# EAGLE design Mimi_layout (EAGLE 7.6.0)

## Sheet 1 of 2
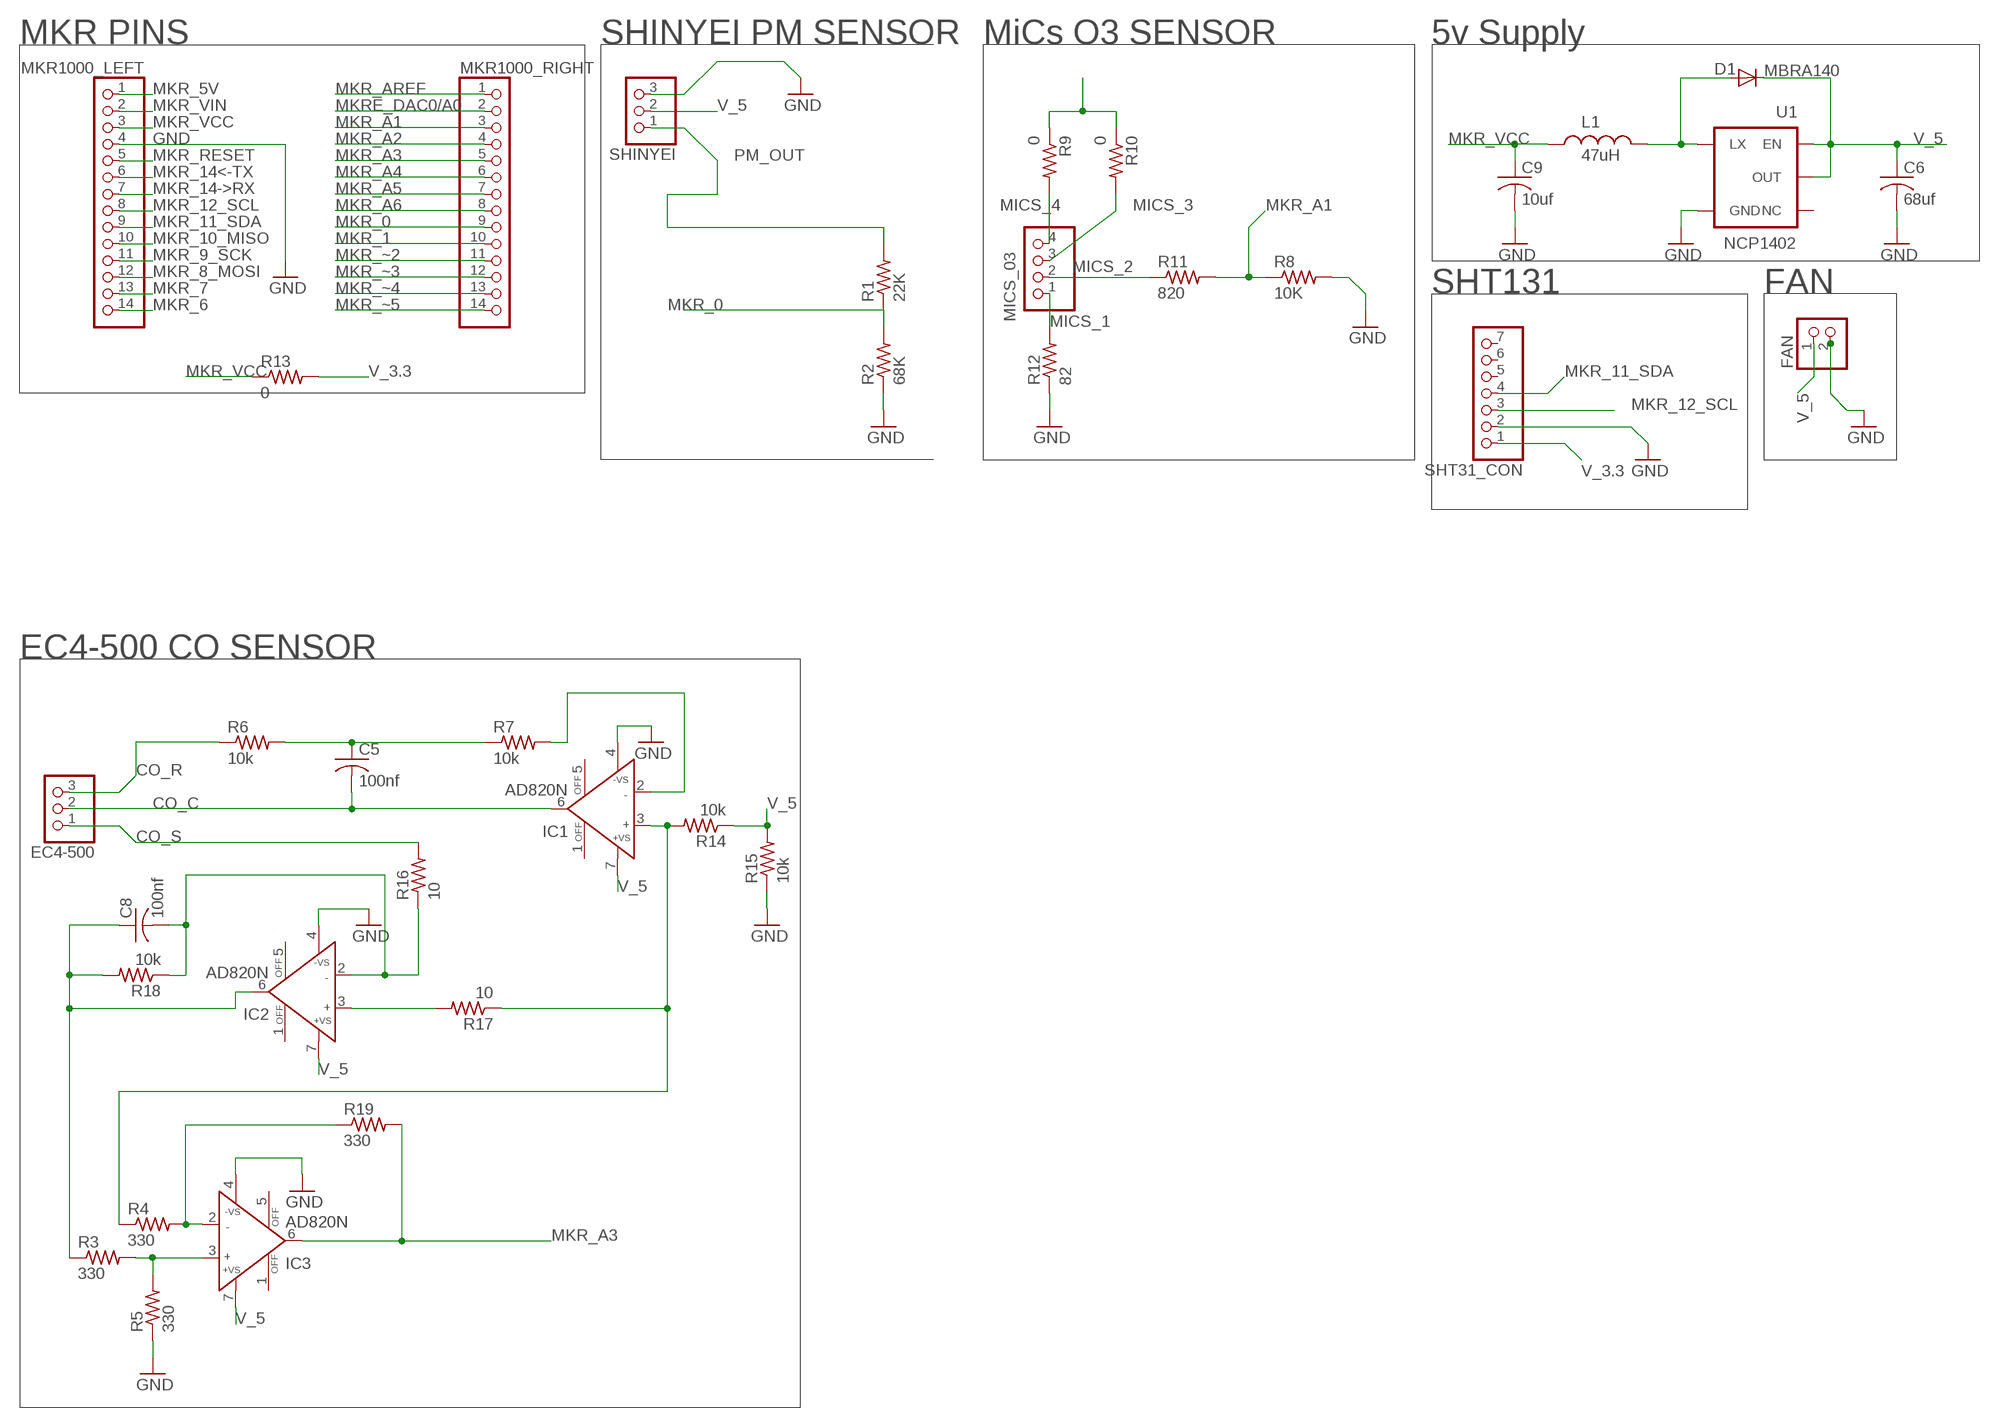
[diagram p0: schematic, sheet 1]

### Parts
C5  100nf  C-USC0805  [C0805]
C6  68uf  C-USC0805  [C0805]
C8  100nf  C-USC0805  [C0805]
C9  10uf  C-USC0805  [C0805]
D1  MBRA140  DIODESMA  [SMA-DIODE]
EC4-500  PINHD-1X3  [1X03]
FAN  PINHD-1X2  [1X02]
IC1  AD820N  [DIL08]
IC2  AD820N  [DIL08]
IC3  AD820N  [DIL08]
L1  47uH  INDUCTORCR54  [CR54]
MICS_03  PINHD-1X4  [1X04]
MKR1000_LEFT  PINHD-1X14  [1X14]
MKR1000_RIGHT  PINHD-1X14  [1X14]
R1  22K  R-US_R0805  [R0805]
R2  68K  R-US_R0805  [R0805]
R3  330  R-US_R0805  [R0805]
R4  330  R-US_R0805  [R0805]
R5  330  R-US_R0805  [R0805]
R6  10k  R-US_R0805  [R0805]
R7  10k  R-US_R0805  [R0805]
R8  10K  R-US_R0805  [R0805]
R9  0  R-US_R0805  [R0805]
R10  0  R-US_R0805  [R0805]
R11  820  R-US_R0805  [R0805]
R12  82  R-US_R0805  [R0805]
R13  0  R-US_R0805  [R0805]
R14  10k  R-US_R0805  [R0805]
R15  10k  R-US_R0805  [R0805]
R16  10  R-US_R0805  [R0805]
R17  10  R-US_R0805  [R0805]
R18  10k  R-US_R0805  [R0805]
R19  330  R-US_R0805  [R0805]
SHINYEI  PINHD-1X3  [1X03]
SHT31_CON  PINHD-1X7  [1X07]
U1  NCP1402  V_REG_NCP1400SOT23-5  [SOT23-5]

### Nets
CO_C: C5.2 EC4-500.2 IC1.6(OUT)
CO_R: EC4-500.3 R6.1
CO_S: EC4-500.1 R16.2
GND: C6.2 C9.2 FAN.2 IC1.4(-VS) IC2.4(-VS) IC3.4(-VS) MKR1000_LEFT.4 R2.1 R5.1 R8.2 R12.1 R15.1 SHINYEI.3 SHT31_CON.2 U1.4(GND)
MICS_1: MICS_03.1 R12.2
MICS_2: MICS_03.2 R11.1
MICS_3: MICS_03.3 R10.2
MICS_4: MICS_03.4 R9.2
MKR_0: MKR1000_RIGHT.9 R1.1 R2.2
MKR_1: MKR1000_RIGHT.10
MKR_5V: MKR1000_LEFT.1
MKR_6: MKR1000_LEFT.14
MKR_7: MKR1000_LEFT.13
MKR_8_MOSI: MKR1000_LEFT.12
MKR_9_SCK: MKR1000_LEFT.11
MKR_10_MISO: MKR1000_LEFT.10
MKR_11_SDA: MKR1000_LEFT.9 SHT31_CON.4
MKR_12_SCL: MKR1000_LEFT.8 SHT31_CON.3
MKR_14->RX: MKR1000_LEFT.7
MKR_14<-TX: MKR1000_LEFT.6
MKR_A1: MKR1000_RIGHT.3 R8.1 R11.2
MKR_A2: MKR1000_RIGHT.4
MKR_A3: IC3.6(OUT) MKR1000_RIGHT.5 R19.2
MKR_A4: MKR1000_RIGHT.6
MKR_A5: MKR1000_RIGHT.7
MKR_A6: MKR1000_RIGHT.8
MKR_AREF: MKR1000_RIGHT.1
MKR_RESET: MKR1000_LEFT.5
MKR_VCC: C9.1 L1.P$1 MKR1000_LEFT.3 R13.1
MKR_VIN: MKR1000_LEFT.2
MKR_~2: MKR1000_RIGHT.11
MKR_~3: MKR1000_RIGHT.12
MKR_~4: MKR1000_RIGHT.13
MKR_~5: MKR1000_RIGHT.14
MKRE_DAC0/A0: MKR1000_RIGHT.2
N$3: D1.A L1.P$2 U1.5(LX)
N$4: C5.1 R6.2 R7.1
N$5: IC1.3(IN+) R4.1 R14.2 R17.1
N$6: IC1.2(IN-) R7.2
N$7: IC2.3(IN+) R17.2
N$8: C8.2 IC2.2(IN-) R16.1 R18.1
N$9: C8.1 IC2.6(OUT) R3.1 R18.2
N$10: IC3.3(IN+) R3.2 R5.2
N$11: IC3.2(IN-) R4.2 R19.1
PM_OUT: R1.2 SHINYEI.1
V_3.3: R13.2 SHT31_CON.1
V_5: C6.1 D1.C FAN.1 IC1.7(+VS) IC2.7(+VS) IC3.7(+VS) R9.1 R10.1 R14.1 R15.2 SHINYEI.2 U1.1(EN) U1.2(OUT)
Unconnected: IC1.1(OFF) IC1.5(OFF) IC2.1(OFF) IC2.5(OFF) IC3.1(OFF) IC3.5(OFF) SHT31_CON.5 SHT31_CON.6 SHT31_CON.7 U1.3(NC)

### Notes on the sheet
- MKR PINS | SHINYEI PM SENSOR | MiCs O3 SENSOR | 5v Supply
- SHT131 | FAN
- EC4-500 CO SENSOR

## Sheet 2 of 2

## Library data of the parts
C5 C6 C8 C9 = resistor:C-US: CAPACITOR, American symbol
D1 = SparkFun:DIODE: Diode These are standard reverse protection diodes and small signal diodes. SMA package can handle up to about 1A. SOD-323 can handle about 200mA. What the SOD-323 package when ordering, there are some mfgs out there that are 5-pin packages.
EC4-500 SHINYEI = pinhead:PINHD-1X3: PIN HEADER
FAN = pinhead:PINHD-1X2: PIN HEADER
IC1-IC3 = analog-devices:AD820N: Single-Supply, Rail-to-Rail, Low Power, FET Input Op Amp Source: http://www.analog.com/static/imported-files/data_sheets/AD820.pdf; OC_FARNELL: 1438579; OC_NEWARK: unknown
L1 = SparkFun:INDUCTOR: Inductors Basic Inductor/Choke - 0603 and 1206. Footprints are not proven and vary greatly between part numbers.
MICS_03 = pinhead:PINHD-1X4: PIN HEADER
MKR1000_LEFT MKR1000_RIGHT = pinhead:PINHD-1X14: PIN HEADER
R1-R19 = resistor:R-US_: RESISTOR, American symbol
SHT31_CON = pinhead:PINHD-1X7: PIN HEADER
U1 = SparkFun:V_REG_NCP1400: Switching step-up voltage regulator NCP1400 switiching regulator takes single cell AA and outputs 100mA at 3.3V or 5V with minimal number of external components.

## Board
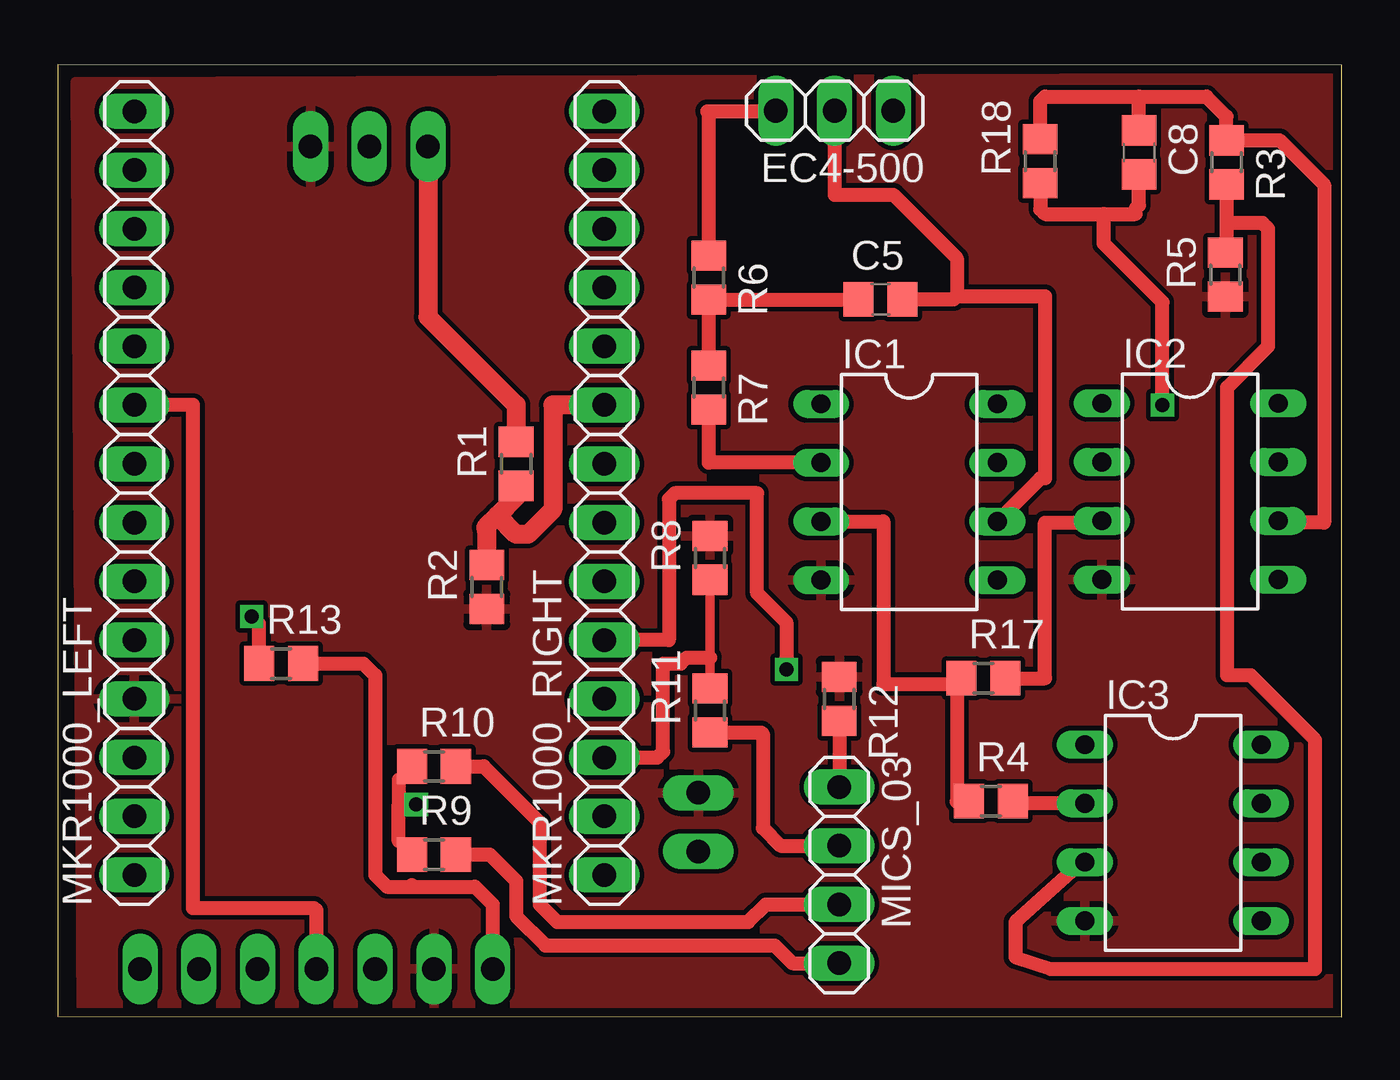
[diagram p1: board, top side]
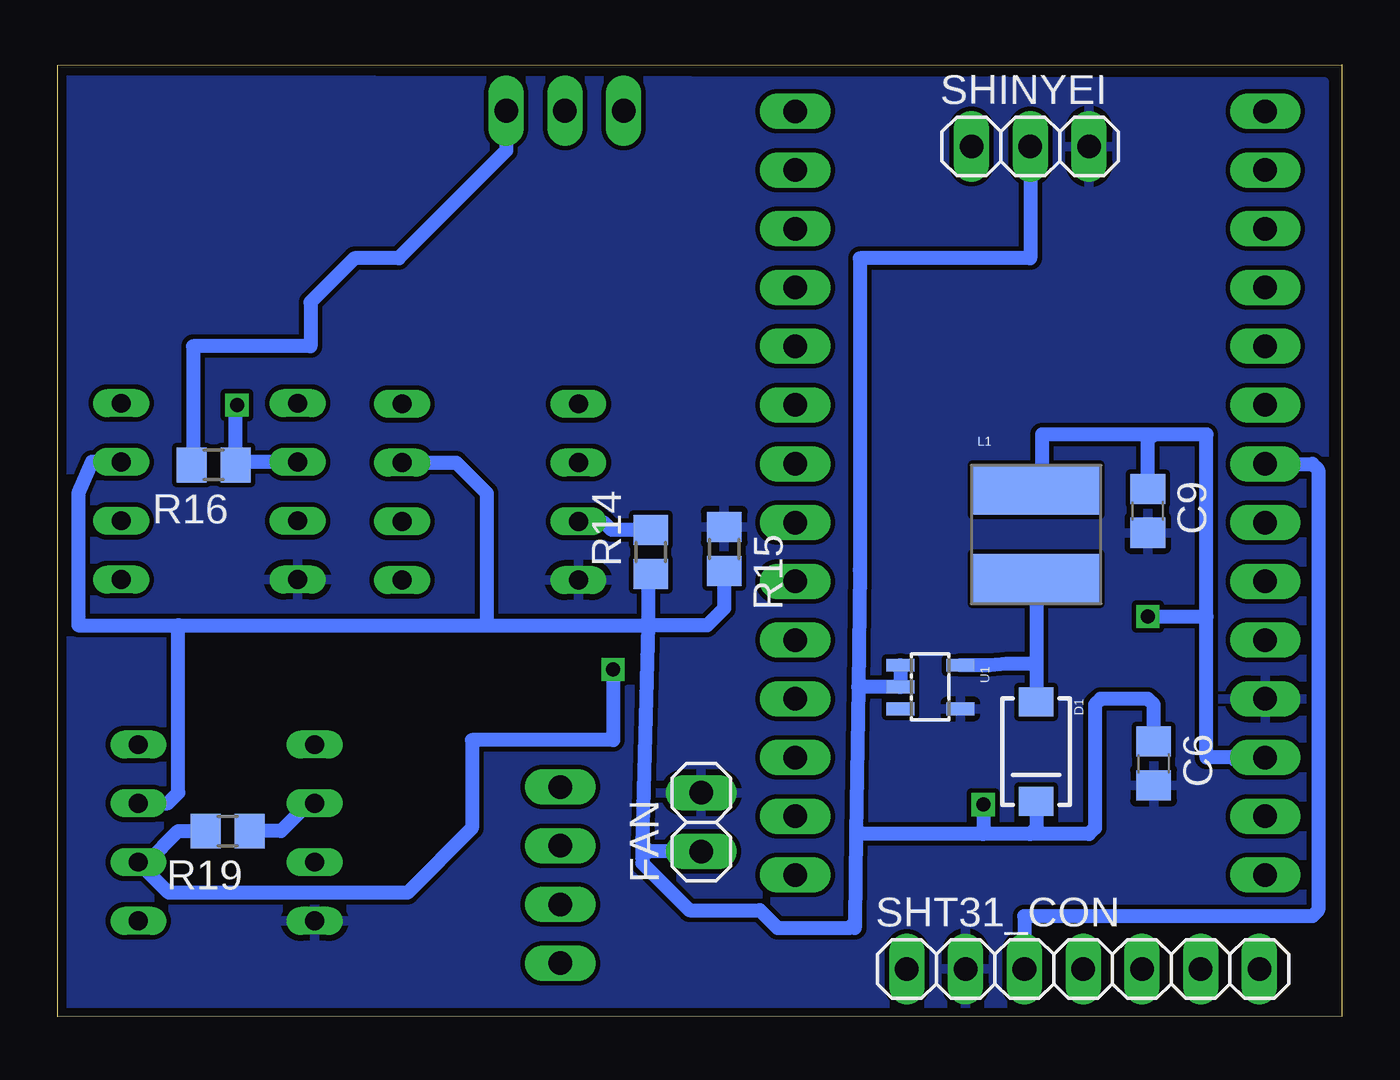
[diagram p2: board, bottom side, seen from below]

Size 55.5 x 41.16 mm. Coordinates in mm from the lower left corner, seen from the top.
Outline: 0,0.03 55.5,0 55.5,41.14 0,41.16 0,0.03
Copper layers (1*16): Top 0.0178mm / dielectric 59mil / Bottom 0.0178mm
Design rules "epl-lpkf": minimum track width 8mil, minimum drill 0.35mm, track to track 8mil, track to pad 8mil, pad to pad 8mil, via to via 8mil, smd to smd 8mil, copper to edge 15mil, drill to drill 15mil, minimum pad ring 8mil, minimum via ring 8mil, stop-mask expansion 3mil, vias tented up to drill 0mil, thermal gap 10mil

### Footprints (pad centres in the part's own frame; a part is rotated, then mirrored left to right if it is on the bottom)
C0805 = smd 1.3 x 1.5: 1 -0.95,0; 2 0.95,0
SMA-DIODE = smd 1.27 x 1.47: A -2.15,0; C 2.15,0
1X03 = drill 1.016 long: 1 -2.54,0; 2 0,0; 3 2.54,0
1X02 = drill 1.016 long: 1 -1.27,0; 2 1.27,0
DIL08 = drill 0.813 long: 1 -3.81,-3.81; 2 -1.27,-3.81; 3 1.27,-3.81; 4 3.81,-3.81; 5 3.81,3.81; 6 1.27,3.81; 7 -1.27,3.81; 8 -3.81,3.81
CR54 = smd 5.5 x 2.15: P$1 0,1.92; P$2 0,-1.92
1X04 = drill 1.016 long: 1 -3.81,0; 2 -1.27,0; 3 1.27,0; 4 3.81,0
1X14 = drill 1.016 long: 1 -16.51,0; 2 -13.97,0; 3 -11.43,0; 4 -8.89,0; 5 -6.35,0; 6 -3.81,0; 7 -1.27,0; 8 1.27,0; 9 3.81,0; 10 6.35,0; 11 8.89,0; 12 11.43,0; 13 13.97,0; 14 16.51,0
R0805 = smd 1.3 x 1.5: 1 -0.95,0; 2 0.95,0
1X07 = drill 1.016 long: 1 -7.62,0; 2 -5.08,0; 3 -2.54,0; 4 0,0; 5 2.54,0; 6 5.08,0; 7 7.62,0
SOT23-5 = smd 0.55 x 1.2: 1 -0.95,-1.3; 2 0,-1.3; 3 0.95,-1.3; 4 0.95,1.3; 5 -0.95,1.3

### Placement (x,y rotation side)
C5  35.56,31.01 0 top
C6  8.13,10.95 270 bottom
C8  46.74,37.36 270 top
C9  8.38,21.87 270 bottom
D1  13.21,11.46 270 bottom
EC4-500  33.58,39.17 180 top
FAN  27.69,8.41 90 bottom
IC1  36.8,22.68 270 top
IC2  48.95,22.71 270 top
IC3  48.21,7.95 270 top
L1  13.21,20.85 0 bottom
MICS_03  33.78,6.12 270 top
MKR1000_LEFT  3.3,22.63 90 top
MKR1000_RIGHT  23.62,22.63 90 top
R1  19.81,23.9 90 top
R2  18.54,18.57 90 top
R3  50.52,36.93 270 top
R4  40.34,9.32 0 top
R5  50.47,32.08 90 top
R6  28.14,31.95 270 top
R7  28.14,27.2 270 top
R8  28.19,19.84 90 top
R9  16.26,7.01 0 top
R10  16.26,10.82 0 top
R11  28.19,13.23 90 top
R12  33.78,13.74 270 top
R13  9.65,15.27 0 top
R14  29.87,20.09 90 bottom
R15  26.7,20.22 270 bottom
R16  48.77,23.85 180 bottom
R17  40.01,14.63 0 top
R18  42.47,36.98 90 top
R19  48.16,8.03 180 bottom
SHINYEI  13.46,37.62 0 bottom
SHT31_CON  11.18,2.06 0 bottom
U1  17.78,14.25 270 bottom

### Tracks (layer width: path | path; a pad name or v marks a point on that pad's centre or on a via)
CO_C
  Top 0.61: 38.86,31.14 42.67,31.14 42.67,23.27 42.47,23.27 IC1.6 | EC4-500.2 33.58,35.53 36.12,35.53 38.86,32.79 38.86,31.14 | C5.2 38.73,31.01 38.86,31.14
CO_R
  Top 0.61: R6.1 28.14,39.07 28.07,39.14 31.01,39.14 EC4-500.3
CO_S
  Bottom 0.61: EC4-500.1 36.12,37.44 40.77,32.79 42.67,32.79 44.58,30.89 44.58,28.98 49.66,28.98 49.66,23.91 R16.2
GND
  pour Bottom: 0.76,40.41 55.45,40.51 55.45,0.13 0.76,0.03
  pour Top: 0.76,40.41 55.45,40.61 55.7,0.23 1.02,0.03
MICS_1
  Top 0.61: R12.2 MICS_03.1
MICS_2
  Top 0.61: 33.78,7.71 MICS_03.2 31.24,7.39 30.48,8.15 30.48,12.22 30.41,12.28 R11.1
MICS_3
  Top 0.61: MICS_03.3 30.61,4.85 29.84,4.09 21.59,4.09 20.83,4.85 20.83,8.41 18.41,10.82 R10.2
MICS_4
  Top 0.61: MICS_03.4 31.75,2.31 30.99,3.07 21.08,3.07 19.81,4.34 19.81,5.87 18.67,7.01 R9.2
MKR_0
  Top 0.813: MKR1000_RIGHT.9 21.4,26.44 21.4,21.94 20.32,20.85 19.81,20.85 19,21.67 | R2.2 18.54,20.96 18.49,21.16 19,21.67 | R1.1 19.81,22.48 19,21.67
MKR_11_SDA
  Top 0.61: MKR1000_LEFT.9 5.84,26.44 5.84,4.7 11.07,4.7 11.18,4.6 SHT31_CON.4
MKR_12_SCL
  Bottom 0.61: MKR1000_LEFT.8 1.27,23.9 1.02,23.65 1.02,4.6 1.27,4.34 13.72,4.34 SHT31_CON.3
MKR_A1
  Top 0.406: R11.2 28.19,15.52 R8.1
  Top 0.61: MKR1000_RIGHT.3 25.91,11.2 26.16,11.46 26.16,15.27 26.92,15.27 27.18,15.52 28.19,15.52
MKR_A3  (via drill 0.6)
  Top 0.61: v31.5,15.01 31.5,17.04 30.23,18.31 30.23,22.63 26.67,22.63 26.42,22.38 26.42,16.28 MKR1000_RIGHT.5
  Bottom 0.61: R19.2 50.29,8.03 51.64,6.68 IC3.6 50.7,5.36 40.39,5.36 37.59,8.15 37.59,11.96 31.5,11.96 v31.5,15.01
MKR_VCC  (via drill 0.6)
  Top 0.61: R13.1 8.7,16.98 v8.38,17.3
  Bottom 0.61: 8.13,25.17 5.84,25.17 5.84,17.3 | 8.13,25.17 12.95,25.17 12.95,23.03 L1.P$1 | 4.57,11.2 5.84,11.2 5.84,17.3 | v8.38,17.3 5.84,17.3 | C9.1 8.38,24.92 8.13,25.17
  Bottom 0.813: MKR1000_LEFT.3 4.57,11.2
N$3
  Bottom 0.61: L1.P$2 13.21,15.27 | 13.21,15.27 D1.A | U1.5 15.24,15.2 14.48,15.27 13.21,15.27
N$4
  Top 0.61: R7.1 R6.2 34.61,31 C5.1
N$5
  Top 0.61: IC1.3 35.69,21.41 35.69,14.38 38.86,14.38 | R17.1 39.05,14.38 38.86,14.38 | 38.86,14.38 38.86,9.3 39.38,9.3 R4.1
  Bottom 0.61: R14.2 31.56,21.04 31.88,21.36 32.94,21.36 IC1.3
N$6
  Top 0.61: IC1.2 28.14,23.95 R7.2
N$7
  Top 0.61: R17.2 42.67,14.63 42.67,21.36 45.14,21.36 IC2.3
N$8  (via drill 0.6)
  Top 0.61: R18.1 42.47,34.9 42.67,34.7 45.21,34.7 | 45.21,34.7 46.59,34.7 46.59,34.93 46.74,35.08 C8.2 | v47.75,26.44 47.75,30.89 45.21,33.43 45.21,34.7
  Bottom 0.61: IC2.2 47.82,23.98 | 47.82,23.98 R16.1 | 47.82,23.98 47.82,26.38 v47.75,26.44
N$9
  Top 0.61: R18.2 42.47,39.57 42.67,39.78 46.74,39.78 | 46.74,39.78 49.66,39.78 50.52,38.91 R3.1 52.82,37.88 54.74,35.97 54.74,21.36 52.83,21.36 IC2.6 | C8.1 46.74,39.78
N$10
  Top 0.61: R3.2 50.52,34.32 | 50.52,34.32 50.52,33.08 R5.2 | IC3.3 44.25,6.68 41.4,4.09 41.4,2.57 42.93,2.06 54.36,2.06 54.36,11.96 51.56,14.76 50.55,14.76 50.55,27.2 52.32,28.98 52.32,34.06 52.07,34.32 50.52,34.32
N$11
  Top 0.61: IC3.2 41.39,9.22 R4.2
  Bottom 0.61: IC3.2 44.65,9.22 45.85,8.03 R19.1
PM_OUT
  Top 0.813: SHINYEI.1 16,30.25 19.81,26.44 R1.2
V_3.3
  Top 0.61: 15.31,5.68 15.24,5.61 | 15.24,5.61 18.03,5.61 18.8,4.85 SHT31_CON.1 | R13.2 13.21,15.27 13.72,14.76 13.72,6.12 14.22,5.61 15.24,5.61
V_5  (via drill 0.6)
  Top 0.406: R10.1 14.73,10.25 | R9.1 14.73,7.58
  Top 0.61: 14.73,10.25 14.73,9.17 | 14.73,9.17 v15.49,9.17 | 14.73,7.58 14.73,9.17
  Bottom 0.61: 20.9,14.26 20.83,19.33 20.83,32.79 13.46,32.79 SHINYEI.2 | 20.9,14.26 20.97,9.17 | 20.97,9.17 20.99,7.91 | 20.99,7.91 21.04,4.08 | 21.04,4.08 21.04,3.84 | 30.21,7.4 30.23,6.88 30.23,6.63 28.19,4.6 25.15,4.6 24.38,3.84 21.29,3.84 21.04,4.08 | 30.21,7.4 29.97,16.92 | 29.97,16.92 29.97,19.04 R14.1 | R15.2 26.7,17.65 27.43,16.92 29.97,16.92 | IC1.7 38.28,23.95 36.96,22.63 36.96,16.92 | 36.96,16.92 29.97,16.92 | IC2.7 54.03,23.98 54.61,22.63 54.61,16.92 50.29,16.92 | 50.29,16.92 36.96,16.92 | IC3.7 50.75,9.22 50.29,9.68 50.29,16.92 | U1.1 U1.2 20.89,14.25 20.9,14.26 | 20.97,9.42 20.97,9.17 | FAN.1 29.95,7.14 30.21,7.4 | 13.46,7.9 10.92,7.9 10.67,8.15 10.67,13.49 10.41,13.74 8.38,13.74 8.13,13.49 C6.1 | 13.46,7.9 15.49,7.9 | 15.49,7.9 20.98,7.9 20.99,7.91 | D1.C 13.21,8.15 13.46,7.9 | v15.49,9.17 15.49,7.9